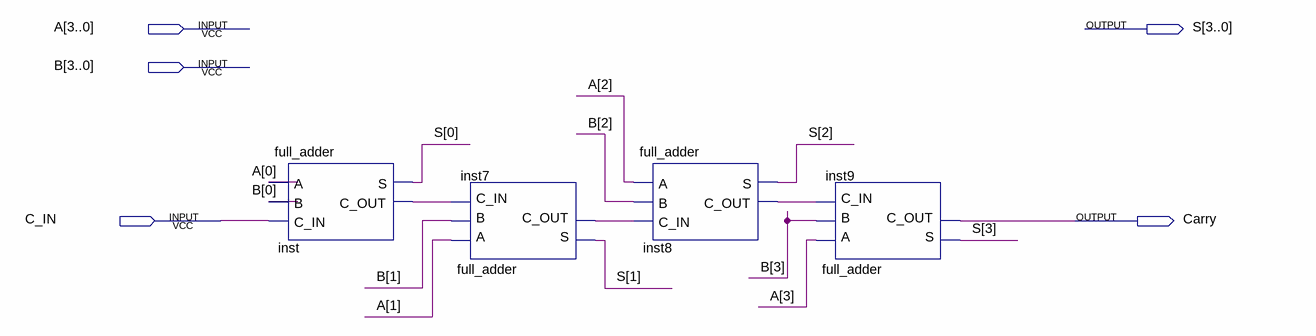
[diagram p0: schematic sheet]
// Quartus schematic RCA.bdf as structural Verilog: 4 symbols, 5 pins
module RCA (
  input  [3:0] A,
  input  [3:0] B,
  input  C_IN,
  output [3:0] S,
  output Carry
);

  wire inst7_c_out, inst8_c_out, inst_c_out;

  full_adder inst (.A(A[0]), .B(B[0]), .C_IN(C_IN), .S(S[0]), .C_OUT(inst_c_out));
  full_adder inst7 (.A(A[1]), .B(B[1]), .C_IN(inst_c_out), .S(S[1]), .C_OUT(inst7_c_out));
  full_adder inst8 (.A(A[2]), .B(B[2]), .C_IN(inst7_c_out), .S(S[2]), .C_OUT(inst8_c_out));
  full_adder inst9 (.A(A[3]), .B(B[3]), .C_IN(inst8_c_out), .S(S[3]), .C_OUT(Carry));
endmodule
